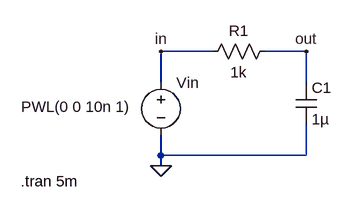
[diagram p0: schematic TRAN.asc]
TRAN.asc, the LTspice schematic file:
Version 4
SHEET 1 880 680
WIRE 160 96 80 96
WIRE 304 96 240 96
WIRE 80 144 80 96
WIRE 304 144 304 96
WIRE 80 256 80 224
WIRE 304 256 304 208
WIRE 304 256 80 256
WIRE 80 272 80 256
FLAG 80 272 0
FLAG 80 96 in
FLAG 304 96 out
SYMBOL voltage 80 128 R0
WINDOW 3 -215 53 Left 2
WINDOW 123 0 0 Left 0
WINDOW 39 0 0 Left 0
SYMATTR InstName Vin
SYMATTR Value PWL(0 0 10n 1)
SYMBOL res 144 112 R270
WINDOW 0 32 56 VTop 2
WINDOW 3 0 56 VBottom 2
SYMATTR InstName R1
SYMATTR Value 1k
SYMBOL cap 288 144 R0
SYMATTR InstName C1
SYMATTR Value 1µ
TEXT -136 296 Left 2 !.tran 5m

The netlist it stands for:
* TRAN.asc
Vin in 0 PWL(0 0 10n 1)
R1 in out 1k
C1 out 0 1µ
.tran 5m
.backanno
.end

* Results of the author's LTspice run, read from the files saved beside the schematic
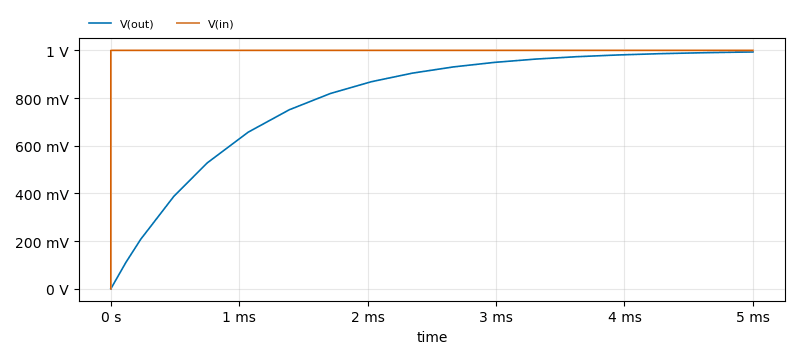
[diagram p1: Transient Analysis of TRAN.asc, plotted from the saved traces]
* Transient Analysis, 1 run:
*   V(out): min 0 V, max 993.3 mV, average 800.2 mV, rms 837.9 mV, last 993.3 mV
*   V(in): min 0 V, max 1 V, average 1 V, rms 1 V, last 1 V